# EAGLE design radio_jammer (EAGLE 6.6.0)
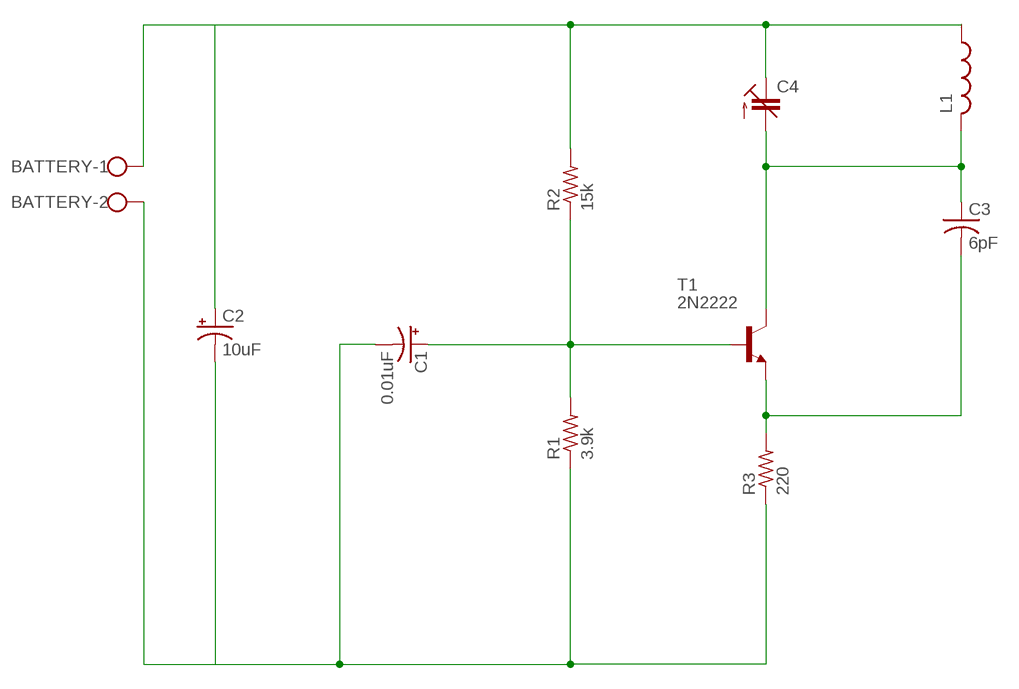
[diagram p0: schematic, sheet 1]

## Parts
BATTERY  W237-102  [W237-102]
C1  0.01uF  CPOL-USB45181A  [B45181A]
C2  10uF  CPOL-USB45181A  [B45181A]
C3  6pF  C-US025-025X050  [C025-025X050]
C4  C-TRIMM3050.504  [CTRIM3050.504]
L1  L-US0204/7  [0204/7]
R1  3.9k  R-US_0204/7  [0204/7]
R2  15k  R-US_0204/7  [0204/7]
R3  220  R-US_0204/7  [0204/7]
T1  2N2222  [TO18]

## Nets
N$1: C1.+ R1.2 R2.1 T1.2(B)
N$2: BATTERY.2 C1.- C2.- R1.1 R3.1
N$3: C3.2 R3.2 T1.1(E)
N$5: C3.1 C4.2(A) L1.2 T1.3(C)
N$6: BATTERY.1 C2.+ C4.1(E) L1.1 R2.2

## Library data of the parts
BATTERY = con-wago-500:W237-102: WAGO SCREW CLAMP; MPN: 237-102; OC_FARNELL: unknown; OC_NEWARK: 70K9898
C1 C2 = resistor:CPOL-US: POLARIZED CAPACITOR, American symbol
C3 = resistor:C-US: CAPACITOR, American symbol
C4 = resistor:C-TRIMM: Trimm capacitor
L1 = resistor:L-US: INDUCTOR, American symbol
R1-R3 = resistor:R-US_: RESISTOR, American symbol
T1 = transistor-neu-to92:2N2222: NPN TRANSISTOR

## Board
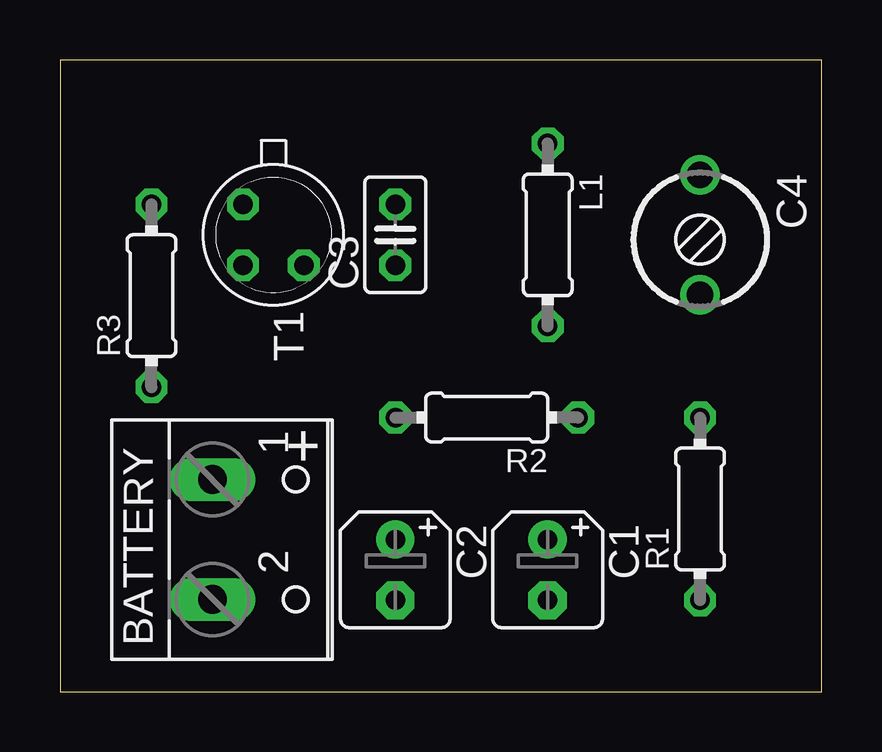
[diagram p1: board, top side]
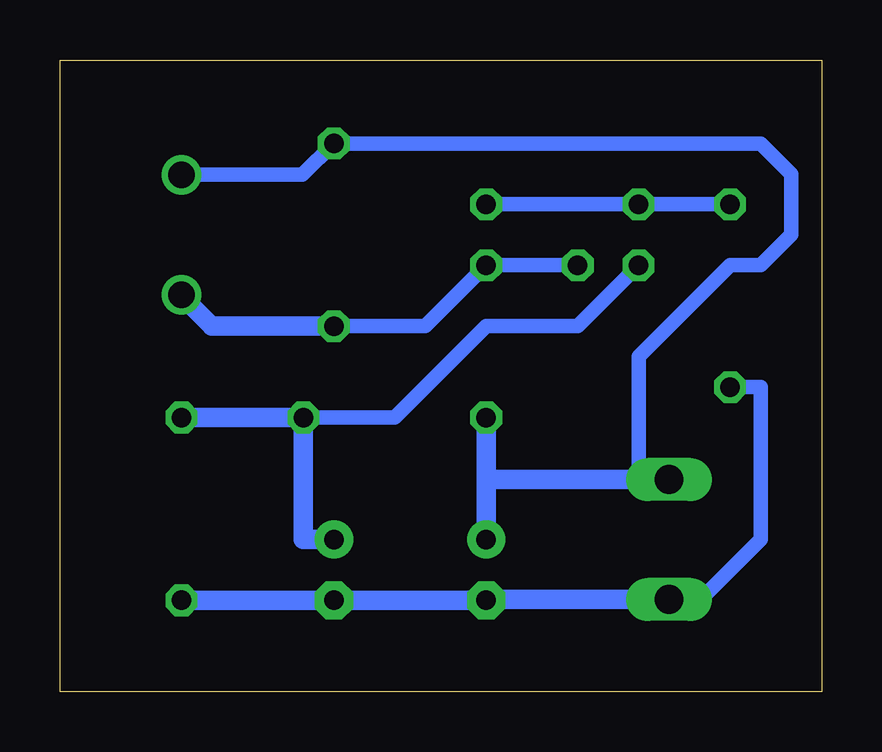
[diagram p2: board, bottom side, seen from below]

Size 31.73 x 26.34 mm. Coordinates in mm from the lower left corner, seen from the top.
Outline: 0,0 31.73,0 31.73,26.34 0,26.34 0,0
Copper layers (1*16): Top 0.035mm / dielectric 1.5mm / Bottom 0.035mm
Design rules "default": minimum track width 10mil, minimum drill 24mil, track to track 8mil, track to pad 8mil, pad to pad 8mil, via to via 8mil, smd to smd 8mil, copper to edge 40mil, drill to drill 8mil, minimum pad ring 10mil, minimum via ring 8mil, stop-mask expansion 4mil, vias tented up to drill 0mil, thermal gap 10mil

### Footprints (pad centres in the part's own frame; a part is rotated, then mirrored left to right if it is on the bottom)
W237-102 = drill 1.194 long: 1 -2.5,-1.27; 2 2.5,-1.27
B45181A = drill 0.813 pad 1.6: + -1.27,0 | drill 0.813 pad 1.6 octagon: - 1.27,0
C025-025X050 = drill 0.813 octagon: 1 -1.27,0; 2 1.27,0
CTRIM3050.504 = drill 1.1: 1 -2.5,0; 2 2.5,0
0204/7 = drill 0.813 octagon: 1 -3.81,0; 2 3.81,0
TO18 = drill 0.813 octagon: 1 -1.27,-1.27; 2 1.27,-1.27; 3 1.27,1.27

### Placement (x,y rotation side)
BATTERY  7.62,6.35 270 top
C1  20.32,5.08 270 top
C2  13.97,5.08 270 top
C3  13.97,19.05 90 top
C4  26.67,19.05 270 top
L1  20.32,19.05 270 top
R1  26.67,7.62 90 top
R2  17.78,11.43 180 top
R3  3.81,16.51 90 top
T1  8.89,19.05 270 top

### Tracks (layer width: path | path; a pad name or v marks a point on that pad's centre or on a via)
N$1
  Bottom 0.61: R2.1 17.78,11.43 13.97,15.24 10.16,15.24 T1.2
  Bottom 0.813: C1.+ 21.59,6.35 R2.1 R1.2
N$2
  Bottom 0.61: R3.1 2.54,12.7 2.54,6.35 5.08,3.81 6.35,3.81 BATTERY.2
  Bottom 0.813: BATTERY.2 13.97,3.85 C2.- C1.- R1.1
N$3
  Bottom 0.61: C3.2 T1.1 R3.2
N$5
  Bottom 0.61: L1.2 16.51,15.24 C3.1 T1.3
  Bottom 0.813: L1.2 25.4,15.24 26.67,16.51 C4.2
N$6
  Bottom 0.61: C4.1 21.63,21.55 L1.1 2.54,22.86 1.27,21.59 1.27,19.05 2.54,17.78 3.81,17.78 7.62,13.97 7.62,8.85
  Bottom 0.813: C2.+ 13.97,8.85 | 13.97,8.85 R2.2 | BATTERY.1 7.62,8.85 13.97,8.85

### Text on the board
tNames: +